# Altium schematic sheet Mother_Board.SchDoc
size A2; Author: Yaokun/Felix Zhang; Organization: Altium Limited; Address1: 21A144; Address2: Harbin Engineering University; Address3: Harbin; Address4: CHINA
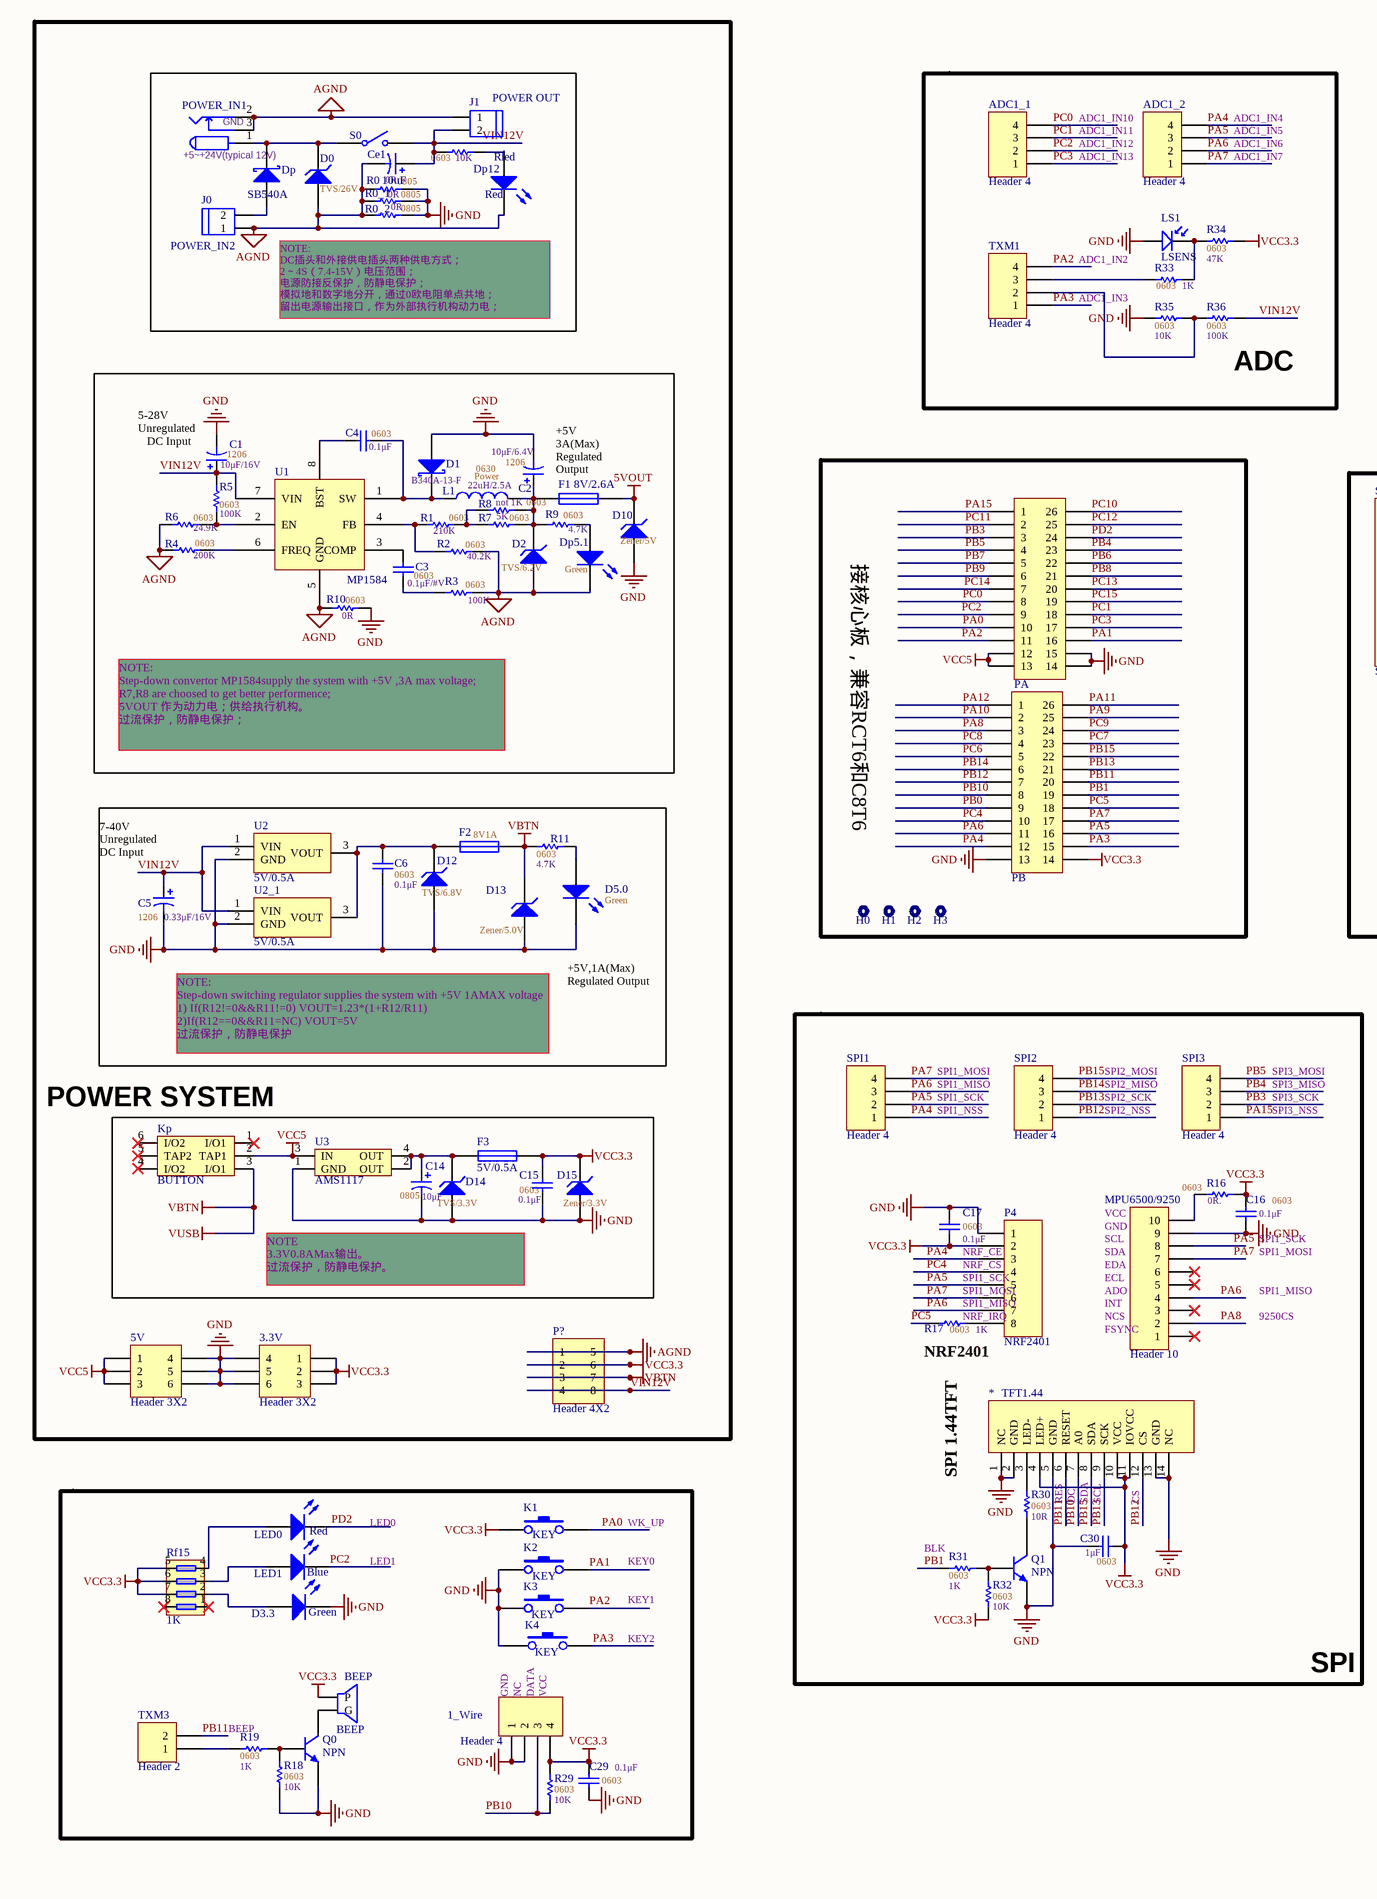
[diagram p0: Mother_Board.SchDoc, left]
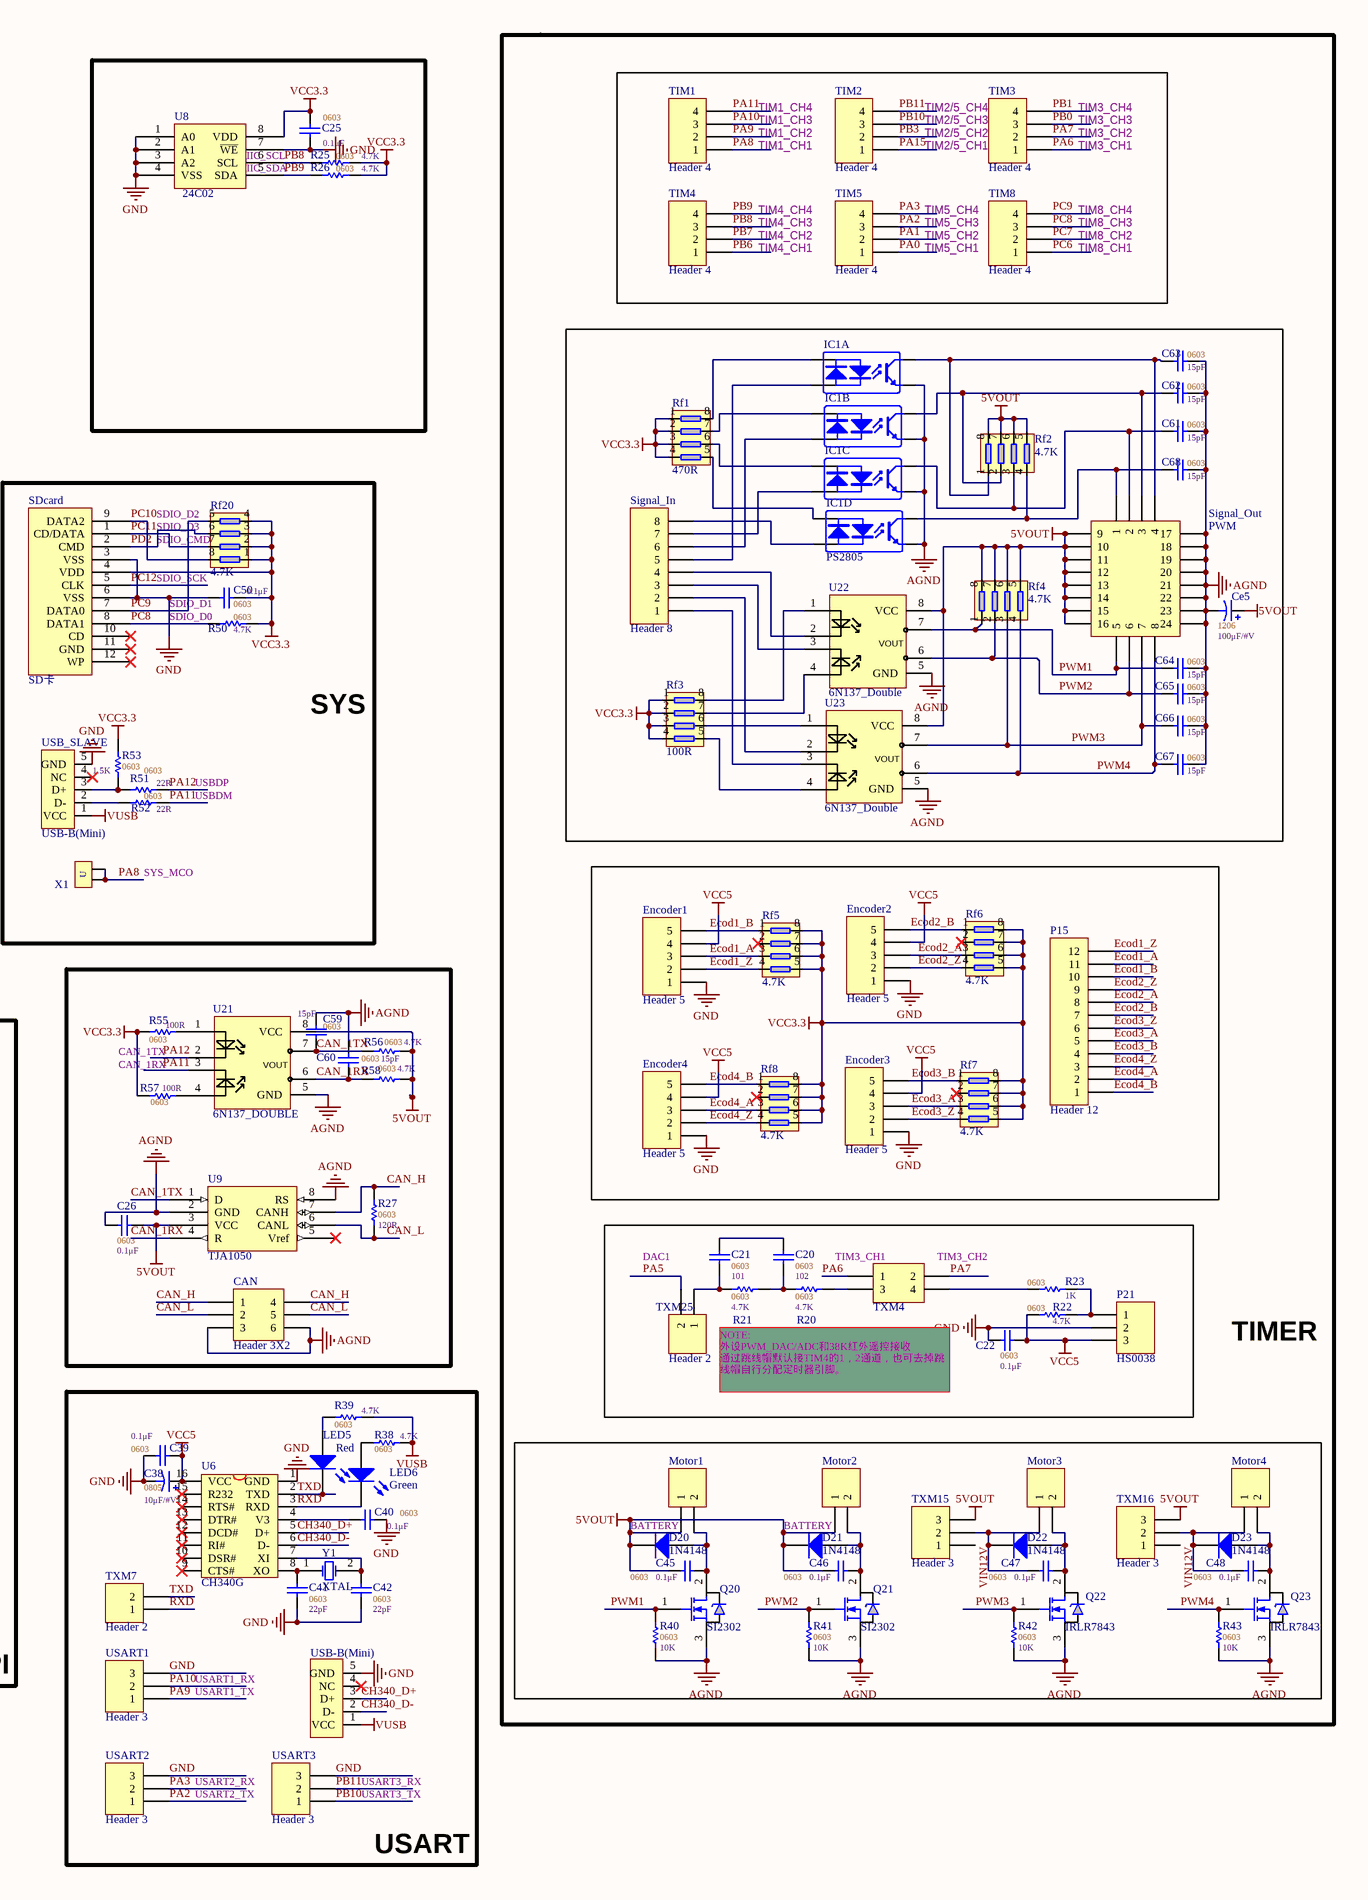
[diagram p1: Mother_Board.SchDoc, right]

## Parts
1_Wire  Header 4  [HEADER1*4_PIN]
3.3V  Header 3X2  [HEADER2*3_PIN]
5V  Header 3X2  [HEADER2*3_PIN]
*  TFT1.44  [TFT_1.44]
ADC1_1  Header 4  [HEADER1*4_PIN]
ADC1_2  Header 4  [HEADER1*4_PIN]
BEEP  BEEP  [BELL-5]
C1  value 10μF/16V  PackageReference: 1206  [CAP_1206]  (hidden comment: Polar)
C2  value 10μF/6.4V  PackageReference: 1206  [CAP_1206]  (hidden comment: Polar)
C3  value 0.1μF/#V  [CAP_0603_16*08]  (hidden comment: 0603)
C4  value 0.1μF  [CAP_0603_16*08]  (hidden comment: 0603)
C5  value 0.33μF/16V  PackageReference: 1206  [CAP_1206]  (hidden comment: Polar)
C6  value 0.1μF  [CAP_0603_16*08]  (hidden comment: 0603)
C14  value 10μF  PackageReference: 0805  [CAP_0805_20*12]  (hidden comment: Polar)
C15  value 0.1μF  [CAP_0603_16*08]  (hidden comment: 0603)
C16  value 0.1μF  [CAP_0603_16*08]  (hidden comment: 0603)
C17  value 0.1μF  [CAP_0603_16*08]  (hidden comment: 0603)
C20  value 102  [CAP_0603_16*08]  (hidden comment: 0603)
C21  value 101  [CAP_0603_16*08]  (hidden comment: 0603)
C22  value 0.1μF  [CAP_0603_16*08]  (hidden comment: 0603)
C25  value 0.1μF  [CAP_0603_16*08]  (hidden comment: 0603)
C26  value 0.1μF  [CAP_0603_16*08]  (hidden comment: 0603)
C29  value 0.1μF  [CAP_0603_16*08]  (hidden comment: 0603)
C30  value 1μF  [CAP_0603_16*08]  (hidden comment: 0603)
C38  value 10μF/#V  PackageReference: 0805  [CAP_0805_20*12]  (hidden comment: Polar)
C39  value 0.1μF  [CAP_0603_16*08]  (hidden comment: 0603)
C40  value 0.1μF  [CAP_0603_16*08]  (hidden comment: 0603)
C41  value 22pF  [CAP_0603_16*08]  (hidden comment: 0603)
C42  value 22pF  [CAP_0603_16*08]  (hidden comment: 0603)
C45  value 0.1μF  [CAP_0603_16*08]  (hidden comment: 0603)
C46  value 0.1μF  [CAP_0603_16*08]  (hidden comment: 0603)
C47  value 0.1μF  [CAP_0603_16*08]  (hidden comment: 0603)
C48  value 0.1μF  [CAP_0603_16*08]  (hidden comment: 0603)
C50  value 0.1μF  [CAP_0603_16*08]  (hidden comment: 0603)
C59  value 15pF  [CAP_0603_16*08]  (hidden comment: 0603)
C60  value 15pF  [CAP_0603_16*08]  (hidden comment: 0603)
C61  value 15pF  [CAP_0603_16*08]  (hidden comment: 0603)
C62  value 15pF  [CAP_0603_16*08]  (hidden comment: 0603)
C63  value 15pF  [CAP_0603_16*08]  (hidden comment: 0603)
C64  value 15pF  [CAP_0603_16*08]  (hidden comment: 0603)
C65  value 15pF  [CAP_0603_16*08]  (hidden comment: 0603)
C66  value 15pF  [CAP_0603_16*08]  (hidden comment: 0603)
C67  value 15pF  [CAP_0603_16*08]  (hidden comment: 0603)
C68  value 15pF  [CAP_0603_16*08]  (hidden comment: 0603)
CAN  Header 3X2  [HEADER2*3_PIN]
Ce1  10uF  [Cap_elc_330uF16V]
Ce5  value 100μF/#V  PackageReference: 1206  [C1210_M]  (hidden comment: Polar)
D0  TVS/26V  [SMB]
D1  B340A-13-F  [SMA]
D2  TVS/6.2V  [SOD523]
D3.3  Green  [LED_0805]
D5.0  Green  [LED_0805]
D10  Zener/5V  [SOD123]
D12  TVS/6.8V  [SOD523]
D13  Zener/5.0V  [SOD123]
D14  TVS/3.3V  [SOD523]
D15  Zener/3.3V  [SOD323]
D20  1N4148  [Diode1206]
D21  1N4148  [Diode1206]
D22  1N4148  [Diode1206]
D23  1N4148  [Diode1206]
Dp  SB540A  [SMA]
Dp5.1  Green  [LED_0805]
Dp12  Red  [LED_0805]
Encoder1  Header 5  [P5]
Encoder2  Header 5  [P5]
Encoder3  Header 5  [P5]
Encoder4  Header 5  [P5]
F1  8V/2.6A  [FUSE3.5*5.5]
F2  8V1A  [RES_0805_20*12]
F3  5V/0.5A  [RES_0805_20*12]
H0  Pad3mm  [PAD]  (value not drawn)
H1  Pad3mm  [PAD]  (value not drawn)
H2  Pad3mm  [PAD]  (value not drawn)
H3  Pad3mm  [PAD]  (value not drawn)
IC1  PS2805  [SOP16]  (value not drawn)  (parts A,B,C,D of 4)
J0  POWER_IN2  [POWER_PADS]
J1  POWER OUT  [HEAD2L-0.8]
K1  KEY  [KEY_2]
K2  KEY  [KEY_2]
K3  KEY  [KEY_2]
K4  KEY  [KEY_2]
Kp  BUTTON  [Switch_Self-Lock]
L1  value 22uH/2.5A  PackageReference: 0630  PackageDescription: Power  [IND_SMD22uh]  (hidden comment: MODEL?)
LED0  Red  [LED_0805]
LED1  Blue  [LED_0805]
LED5  Red  [CAP_0603_16*08]
LED6  Green  [CAP_0603_16*08]
LS1  LSENS  [HeadER1*2_pin]
Motor1  Header 2  [HeadER1*2_pin]  (value not drawn)
Motor2  Header 2  [HeadER1*2_pin]  (value not drawn)
Motor3  Header 2  [HeadER1*2_pin]  (value not drawn)
Motor4  Header 2  [HeadER1*2_pin]  (value not drawn)
MPU6500/9250  Header 10  [HEADER1*10_PIN]
P4  NRF2401  [HDR2X4]
P15  Header 12  [HEADER1*12_PIN]
P21  HS0038  [HEADER1*3_PIN]
P?  Header 4X2  [HEADER2*4_PIN]
PA  Header  [HEADER2*13_SMD]  (value not drawn)
PB  Header  [HEADER2*13_SMD]  (value not drawn)
POWER_IN1  POWER  [POW_DC]  (value not drawn)
Q0  NPN  [SOT23_J3Y]
Q1  NPN  [SOT23_J3Y]
Q20  SI2302  [SOT-23_MOSN]
Q21  SI2302  [SOT-23_MOSN]
Q22  IRLR7843  [DPAK]
Q23  IRLR7843  [DPAK]
R0  value 0R  PackageReference: 0805  [RES_0805_20*12]  (hidden comment: SMD)
R0_1  value 0R  PackageReference: 0805  [RES_0805_20*12]  (hidden comment: SMD)
R0_2  value 0R  PackageReference: 0805  [RES_0805_20*12]  (hidden comment: SMD)
R1  0603  value 210K  [RES_0603_16*08]
R2  0603  value 40.2K  [RES_0603_16*08]
R3  0603  value 100K  [RES_0603_16*08]
R4  0603  value 200K  [RES_0603_16*08]
R5  0603  value 100K  [RES_0603_16*08]
R6  0603  value 24.9K  [RES_0603_16*08]
R7  0603  value 5K  [RES_0603_16*08]
R8  0603  value not 1K  [RES_0603_16*08]
R9  value 4.7K  PackageReference: 0603  [RES_0603_16*08]  (hidden comment: SMD)
R10  value 0R  PackageReference: 0603  [RES_0805_20*12]  (hidden comment: SMD)
R11  value 4.7K  PackageReference: 0603  [RES_0603_16*08]  (hidden comment: SMD)
R16  value 0R.  PackageReference: 0603  [RES_0603_16*08]  (hidden comment: SMD)
R17  value 1K  PackageReference: 0603  [RES_0603_16*08]  (hidden comment: SMD)
R18  value 10K  PackageReference: 0603  [RES_0603_16*08]  (hidden comment: SMD)
R19  value 1K  PackageReference: 0603  [RES_0603_16*08]  (hidden comment: SMD)
R20  value 4.7K  PackageReference: 0603  [RES_0603_16*08]  (hidden comment: SMD)
R21  value 4.7K  PackageReference: 0603  [RES_0603_16*08]  (hidden comment: SMD)
R22  value 4.7K  PackageReference: 0603  [RES_0603_16*08]  (hidden comment: SMD)
R23  value 1K  PackageReference: 0603  [RES_0603_16*08]  (hidden comment: SMD)
R25  value 4.7K  PackageReference: 0603  [RES_0603_16*08]  (hidden comment: SMD)
R26  value 4.7K  PackageReference: 0603  [RES_0603_16*08]  (hidden comment: SMD)
R27  value 120R  PackageReference: 0603  [RES_0603_16*08]  (hidden comment: SMD)
R29  value 10K  PackageReference: 0603  [RES_0603_16*08]  (hidden comment: SMD)
R30  value 10R  PackageReference: 0603  [RES_0603_16*08]  (hidden comment: SMD)
R31  value 1K  PackageReference: 0603  [RES_0603_16*08]  (hidden comment: SMD)
R32  value 10K  PackageReference: 0603  [RES_0603_16*08]  (hidden comment: SMD)
R33  value 1K  PackageReference: 0603  [RES_0603_16*08]  (hidden comment: SMD)
R34  value 47K  PackageReference: 0603  [RES_0603_16*08]  (hidden comment: SMD)
R35  value 10K  PackageReference: 0603  [RES_0603_16*08]  (hidden comment: SMD)
R36  value 100K  PackageReference: 0603  [RES_0603_16*08]  (hidden comment: SMD)
R38  value 4.7K  PackageReference: 0603  [RES_0603_16*08]  (hidden comment: SMD)
R39  value 4.7K  PackageReference: 0603  [RES_0603_16*08]  (hidden comment: SMD)
R40  value 10K  PackageReference: 0603  [RES_0603_16*08]  (hidden comment: SMD)
R41  value 10K  PackageReference: 0603  [RES_0603_16*08]  (hidden comment: SMD)
R42  value 10K  PackageReference: 0603  [RES_0603_16*08]  (hidden comment: SMD)
R43  value 10K  PackageReference: 0603  [RES_0603_16*08]  (hidden comment: SMD)
R50  value 4.7K  PackageReference: 0603  [RES_0603_16*08]  (hidden comment: SMD)
R51  value 22R  PackageReference: 0603  [RES_0603_16*08]  (hidden comment: SMD)
R52  value 22R  PackageReference: 0603  [RES_0603_16*08]  (hidden comment: SMD)
R53  value 1.5K  PackageReference: 0603  [RES_0603_16*08]  (hidden comment: SMD)
R55  value 100R  PackageReference: 0603  [RES_0603_16*08]  (hidden comment: SMD)
R56  value 4.7K  PackageReference: 0603  [RES_0603_16*08]  (hidden comment: SMD)
R57  value 100R  PackageReference: 0603  [RES_0603_16*08]  (hidden comment: SMD)
R58  value 4.7K  PackageReference: 0603  [RES_0603_16*08]  (hidden comment: SMD)
Rf1  470R  [RES_FOUR_0603]
Rf2  4.7K  [RES_FOUR_0603]
Rf3  100R  [RES_FOUR_0603]
Rf4  4.7K  [RES_FOUR_0603]
Rf5  4.7K  [RES_FOUR_0603]
Rf6  4.7K  [RES_FOUR_0603]
Rf7  4.7K  [RES_FOUR_0603]
Rf8  4.7K  [RES_FOUR_0603]
Rf15  1K  [RES_FOUR_0603]
Rf20  4.7K  [RES_FOUR_0603]
Rled  value 10K  PackageReference: 0603  [RES_0603_16*08]  (hidden comment: SMD)
S0  SW-SPST  [Switch_boat_s]  (value not drawn)
SDcard  SD卡  [SDCARD_L]
Signal_In  Header 8  [HEADER1*8_PIN]
Signal_Out  PWM  [HEADER3*8]
SPI1  Header 4  [HEADER1*4_PIN]
SPI2  Header 4  [HEADER1*4_PIN]
SPI3  Header 4  [HEADER1*4_PIN]
TIM1  Header 4  [HEADER1*4_PIN]
TIM2  Header 4  [HEADER1*4_PIN]
TIM3  Header 4  [HEADER1*4_PIN]
TIM4  Header 4  [HEADER1*4_PIN]
TIM5  Header 4  [HEADER1*4_PIN]
TIM8  Header 4  [HEADER1*4_PIN]
TXM1  Header 4  [HEADER1*4_PIN]
TXM3  Header 2  [HeadER1*2_pin]
TXM4  Header 2X2  [HEADER2*2_PIN]  (value not drawn)
TXM7  Header 2  [HeadER1*2_pin]
TXM15  Header 3  [HEADER1*3_PIN]
TXM16  Header 3  [HEADER1*3_PIN]
TXM25  Header 2  [HeadER1*2_pin]
U1  MP1584  [SOIC8E]
U2  5V/0.5A  [DPAK]
U2_1  5V/0.5A  [DPAK]
U3  AMS1117  [SOT223_M]
U6  CH340G  [SOP16]
U8  24C02  [SO8_M]
U9  TJA1050  [SO8_M]
U21  6N137_DOUBLE  [SMD-8/Option7]
U22  6N137_Double  [SMD-8/Option7]
U23  6N137_Double  [SMD-8/Option7]
USART1  Header 3  [HEADER1*3_PIN]
USART2  Header 3  [HEADER1*3_PIN]
USART3  Header 3  [HEADER1*3_PIN]
USB_SLAVE  USB-B(Mini)  [USB_micro_S]
USB_SLAVE1  USB-B(Mini)  [USB/SM0.8-6H5]
X1  U HDR  [Header_U]  (value not drawn)
Y1  XTAL  [XTAL_US]

## Blocks framed on the sheet
POWER SYSTEM: 3.3V 5V C1-C6 C14 C15 Ce1 D0-D2 D5.0 D10 D12-D15 Dp Dp5.1 Dp12 F1-F3 J0 J1 Kp L1 P? POWER_IN1 R0 R0_1 R0_2 R1-R11 Rled S0 U1 U2 U2_1 U3
TIMER: C20-C22 C45-C48 C61-C68 Ce5 D20-D23 Encoder1-Encoder4 IC1 Motor1-Motor4 P15 P21 Q20-Q23 R20-R23 R40-R43 Rf1-Rf8 Signal_In Signal_Out TIM1-TIM5 TIM8 TXM4 TXM15 TXM16 TXM25 U22 U23
ADC: ADC1_1 ADC1_2 LS1 R33-R36 TXM1
接核心板，兼容RCT6和C8T6: H0-H3 PA PB
SYS: C50 R50-R53 Rf20 SDcard USB_SLAVE X1
SPI: * C16 C17 C30 MPU6500/9250 P4 Q1 R16 R17 R30-R32 SPI1-SPI3
USART: C38-C42 LED5 LED6 R38 R39 TXM7 U6 USART1-USART3 USB_SLAVE1 Y1

## Nets
5VOUT: C26.2 C45.1 C46.1 Ce5.1 D10.2(K) D20.2(K) D21.2(K) F1.2 Motor1.1 Motor2.1 R56.1 R58.1 Rf2.5 Rf2.6 Rf2.7 Rf2.8 Rf4.5 Rf4.6 Rf4.7 Rf4.8 Signal_Out.9 Signal_Out.10 Signal_Out.11 Signal_Out.12 Signal_Out.13 Signal_Out.14 Signal_Out.15 Signal_Out.16 TXM15.3 TXM16.3 U9.3(VCC) U21.8(VCC) U22.8(VCC) U23.8(VCC)
AGND: C26.1 C59.2 C60.2 C61.2 C62.2 C63.2 C64.2 C65.2 C66.2 C67.2 C68.2 CAN.3 CAN.6 Ce1.2 Ce5.2 D0.1(A) D2.1(A) Dp5.1.2(K) Dp12.2(K) IC1.9 IC1.11 IC1.13 IC1.15 J0.1 J1.1 P?.1 P?.5 POWER_IN1.2(GND) POWER_IN1.3(GND) Q20.3(S) Q21.3(S) Q22.3(S) Q23.3(S) R0.1 R0_1.1 R0_2.1 R2.2 R3.1 R4.2 R6.1 R10.1 R40.1 R41.1 R42.1 R43.1 Signal_Out.17 Signal_Out.18 Signal_Out.19 Signal_Out.20 Signal_Out.21 Signal_Out.22 Signal_Out.23 Signal_Out.24 U1.5(GND) U9.2(GND) U9.8(RS) U21.5(GND) U22.5(GND) U23.5(GND)
GND: 1_Wire.1 1_Wire.2 3.3V.4 3.3V.5 3.3V.6 5V.4 5V.5 5V.6 *.1(NC) *.2(GND) *.5(GND) *.13(GND) *.14(NC) C1.2 C2.2 C5.2 C6.1 C14.2 C15.1 C16.1 C17.2 C22.2 C25.1 C29.1 C30.1 C38.2 C39.1 C40.2 C41.1 C42.1 C50.1 D1.1(A) D3.3.2(K) D5.0.2(K) D10.1(A) D12.1(A) D13.1(A) D14.1(A) D15.1(A) Encoder1.1 Encoder2.1 Encoder3.1 Encoder4.1 K2.1 K3.1 K4.1 LS1.1 MPU6500/9250.9 P4.1 P21.2 PA.14 PA.15 PB.13 Q0.3(E) Q1.3(E) R0.2 R0_1.2 R0_2.2 R10.2 R18.1 R35.1 SDcard.3(VSS) SDcard.6(VSS) U2.2(GND) U2_1.2(GND) U3.1(GND) U6.1(GND) U8.1(A0) U8.2(A1) U8.3(A2) U8.4(VSS) U8.7(~{WE}) USART1.3 USART2.3 USART3.3 USB_SLAVE.5(GND) USB_SLAVE1.5(GND)
VBTN: D13.2(K) F2.2 Kp.3(I/O1) P?.3 P?.7 R11.1 R38.1 R39.2 USB_SLAVE.1(VCC) USB_SLAVE1.1(VCC)  [also labelled VUSB]
VCC3.3: 1_Wire.4 3.3V.1 3.3V.2 3.3V.3 *.4(LED+) *.10(VCC) *.11(IOVCC) BEEP.1(P) C15.2 C16.2 C17.1 C25.2 C29.2 C30.2 C50.2 D15.2(K) F3.2 K1.1 P4.2 P?.2 P?.6 PB.14 R16.1 R25.2 R26.2 R29.2 R32.1 R34.2 R50.2 R53.2 R55.1 R57.1 Rf1.1 Rf1.2 Rf1.3 Rf1.4 Rf3.1 Rf3.2 Rf3.3 Rf3.4 Rf5.5 Rf5.6 Rf5.7 Rf5.8 Rf6.5 Rf6.6 Rf6.7 Rf6.8 Rf7.5 Rf7.6 Rf7.7 Rf7.8 Rf8.5 Rf8.6 Rf8.7 Rf8.8 Rf15.5 Rf15.6 Rf15.7 Rf20.1 Rf20.2 Rf20.3 Rf20.4 SDcard.4(VDD) U8.8(VDD)
VCC5: 5V.1 5V.2 5V.3 C22.1 C38.1 C39.2 Encoder1.4 Encoder2.4 Encoder3.4 Encoder4.4 Kp.2(TAP1) P21.3 PA.12 PA.13 R22.2 U3.3(IN) U6.16(VCC)
CAN_1RX: C60.1 R58.2 U9.4(R) U21.6(VOUT)
CAN_1TX: C59.1 R56.2 U9.1(D) U21.7
CAN_H: CAN.1 CAN.4 R27.2 U9.7(CANH)
CAN_L: CAN.2 CAN.5 R27.1 U9.6(CANL)
CH340_D+: U6.5(D+) USB_SLAVE1.3(D+)
CH340_D-: U6.6(D-) USB_SLAVE1.2(D-)
Ecod1_A: Encoder1.3 P15.11 Rf5.3
Ecod1_B: Encoder1.5 P15.10 Rf5.1
Ecod1_Z: Encoder1.2 P15.12 Rf5.4
Ecod2_A: Encoder2.3 P15.8 Rf6.3
Ecod2_B: Encoder2.5 P15.7 Rf6.1
Ecod2_Z: Encoder2.2 P15.9 Rf6.4
Ecod3_A: Encoder3.3 P15.5 Rf7.3
Ecod3_B: Encoder3.5 P15.4 Rf7.1
Ecod3_Z: Encoder3.2 P15.6 Rf7.4
Ecod4_A: Encoder4.3 P15.2 Rf8.3
Ecod4_B: Encoder4.5 P15.1 Rf8.1
Ecod4_Z: Encoder4.2 P15.3 Rf8.4
PA0: K1.2 PA.10 TIM5.1
PA1: K2.2 PA.16 TIM5.2
PA2: K3.2 PA.11 TIM5.3 TXM1.4 USART2.1
PA3: K4.2 PB.15 TIM5.4 TXM1.1 USART2.2
PA4: ADC1_2.4 P4.3 PB.12 SPI1.1
PA5: ADC1_2.3 MPU6500/9250.8 P4.5 PB.16 SPI1.2 TXM25.2
PA6: ADC1_2.2 MPU6500/9250.4 P4.7 PB.11 SPI1.3 TIM3.1 TXM4.1
PA7: ADC1_2.1 MPU6500/9250.7 P4.6 PB.17 SPI1.4 TIM3.2 TXM4.2
PA8: MPU6500/9250.2 PB.3 TIM1.1 X1.1 X1.2
PA9: PB.25 TIM1.2 USART1.1
PA10: PB.2 TIM1.3 USART1.2
PA11: PB.26 R52.2 TIM1.4 U21.3
PA12: PB.1 R51.2 U21.2
PA15: PA.1 SPI3.1 TIM2.1
PB0: PB.9 TIM3.3
PB1: PB.19 R31.1 TIM3.4
PB3: PA.3 SPI3.2 TIM2.2
PB4: PA.23 SPI3.3
PB5: PA.4 SPI3.4
PB6: PA.22 TIM4.1
PB7: PA.5 TIM4.2
PB8: PA.21 R25.1 TIM4.3 U8.6(SCL)
PB9: PA.6 R26.1 TIM4.4 U8.5(SDA)
PB10: 1_Wire.3 *.7(A0) PB.8 R29.1 TIM2.3 USART3.1
PB11: *.6(RESET) PB.20 TIM2.4 TXM3.2 USART3.2
PB12: *.12(CS) PB.7 SPI2.1
PB13: *.9(SCK) PB.21 SPI2.2
PB14: PB.6 SPI2.3
PB15: *.8(SDA) PB.22 SPI2.4
PC0: ADC1_1.4 PA.8
PC1: ADC1_1.3 PA.18
PC2: ADC1_1.2 LED1.2(K) PA.9
PC3: ADC1_1.1 PA.17
PC4: P4.4 PB.10
PC5: PB.18 R17.1
PC6: PB.5 TIM8.1
PC7: PB.23 TIM8.2
PC8: PB.4 R50.1 SDcard.8(DATA1) TIM8.3
PC9: PB.24 Rf20.5 SDcard.7(DATA0) TIM8.4
PC10: PA.26 Rf20.8 SDcard.9(DATA2)
PC11: PA.2 Rf20.7 SDcard.1(CD/DATA)
PC12: PA.25 SDcard.5(CLK)
PC13: PA.20
PC14: PA.7
PC15: PA.19
PD2: LED0.2(K) PA.24 Rf20.6 SDcard.2(CMD)
PWM1: C64.1 Q20.1(G) R40.2 Rf4.1 Signal_Out.5 U22.7
PWM2: C65.1 Q21.1(G) R41.2 Rf4.2 Signal_Out.6 U22.6(VOUT)
PWM3: C66.1 Q22.1(G) R42.2 Rf4.3 Signal_Out.7 U23.7
PWM4: C67.1 Q23.1(G) R43.2 Rf4.4 Signal_Out.8 U23.6(VOUT)
RXD: LED6.2(K) TXM7.1 U6.3(RXD)
TXD: LED5.2(K) TXM7.2 U6.2(TXD)
VIN12V: C1.1 C5.1 Ce1.1(+) J1.2 P?.4 P?.8 R5.2 R36.2 Rled.2 S0.2(NO) TXM15.1 TXM16.1 U1.7(VIN) U2.1(VIN) U2_1.1(VIN)
Net*_3: *.3(LED-) R30.2
NetBEEP_2: BEEP.2(G) Q0.1(C)
NetC2_1: C2.1 D2.2(K) F1.1 L1.2 R7.2 R8.2 R9.2
NetC3_1: C3.1 R3.2
NetC3_2: C3.2 U1.3(COMP)
NetC4_1: C4.1 U1.8(BST)
NetC4_2: C4.2 D1.2(K) L1.1 U1.1(SW)
NetC6_2: C6.2 D12.2(K) F2.1 U2.3(VOUT) U2_1.3(VOUT)
NetC14_1: C14.1 D14.2(K) F3.1 U3.2(OUT) U3.4(OUT)
NetC20_1: C20.1 C21.1
NetC20_2: C20.2 R20.2 R21.1
NetC21_2: C21.2 R21.2 TXM25.1
NetC40_1: C40.1 U6.4(V3)
NetC41_2: C41.2 U6.8(XO) Y1.1(OSC1)
NetC42_2: C42.2 U6.7(XI) Y1.2(OSC2)
NetC45_2: C45.2 D20.1(A) Motor1.2 Q20.2(D)
NetC46_2: C46.2 D21.1(A) Motor2.2 Q21.2(D)
NetC47_1: C47.1 D22.2(K) Motor3.1 TXM15.2
NetC47_2: C47.2 D22.1(A) Motor3.2 Q22.2(D)
NetC48_1: C48.1 D23.2(K) Motor4.1 TXM16.2
NetC48_2: C48.2 D23.1(A) Motor4.2 Q23.2(D)
NetC61_1: C61.1 IC1.12 Rf2.3 Signal_Out.2
NetC62_1: C62.1 IC1.14 Rf2.2 Signal_Out.3
NetC63_1: C63.1 IC1.16 Rf2.1 Signal_Out.4
NetC68_1: C68.1 IC1.10 Rf2.4 Signal_Out.1
NetD0_2: D0.2(K) Dp.2(K) POWER_IN1.1 S0.1(COMMON)
NetD3.3_1: D3.3.1(A) Rf15.2
NetD5.0_1: D5.0.1(A) R11.2
NetDp5.1_1: Dp5.1.1(A) R9.1
NetDp12_1: Dp12.1(A) Rled.1
NetDp_1: Dp.1(A) J0.2
NetIC1_1: IC1.1 Rf1.8
NetIC1_2: IC1.2 Signal_In.5
NetIC1_3: IC1.3 Rf1.7
NetIC1_4: IC1.4 Signal_In.6
NetIC1_5: IC1.5 Rf1.6
NetIC1_6: IC1.6 Signal_In.7
NetIC1_7: IC1.7 Rf1.5
NetIC1_8: IC1.8 Signal_In.8
NetLED0_1: LED0.1(A) Rf15.4
NetLED1_1: LED1.1(A) Rf15.3
NetLED5_1: LED5.1(A) R39.1
NetLED6_1: LED6.1(A) R38.2
NetLS1_2: LS1.2 R33.2 R34.1
NetMPU6500/9250_10: MPU6500/9250.10 R16.2
NetP4_8: P4.8 R17.2
NetP21_1: P21.1 R22.1 R23.2
NetQ0_2: Q0.2(B) R18.2 R19.2
NetQ1_1: Q1.1(C) R30.1
NetQ1_2: Q1.2(B) R31.2 R32.2
NetR1_1: R1.1 R2.1 U1.4(FB)
NetR1_2: R1.2 R7.1 R8.1
NetR4_1: R4.1 U1.6(FREQ)
NetR5_1: R5.1 R6.2 U1.2(EN)
NetR19_1: R19.1 TXM3.1
NetR20_1: R20.1 TXM4.3
NetR23_1: R23.1 TXM4.4
NetR33_1: R33.1 TXM1.3
NetR35_2: R35.2 R36.1 TXM1.2
NetR51_1: R51.1 R53.1 USB_SLAVE.3(D+)
NetR52_1: R52.1 USB_SLAVE.2(D-)
NetR55_2: R55.2 U21.1
NetR57_2: R57.2 U21.4
NetRf3_5: Rf3.5 U23.4
NetRf3_6: Rf3.6 U23.1
NetRf3_7: Rf3.7 U22.4
NetRf3_8: Rf3.8 U22.1
NetSignal_In_1: Signal_In.1 U23.3
NetSignal_In_2: Signal_In.2 U23.2
NetSignal_In_3: Signal_In.3 U22.3
NetSignal_In_4: Signal_In.4 U22.2

Not connected (* = marked no-connect by the designer): Kp 1(I/O1)* 4(I/O2)* 5(TAP2)* 6(I/O2)*; MPU6500/9250 1* 3* 5* 6*; Rf5 2*; Rf6 2*; Rf7 2*; Rf8 2*; Rf15 1* 8*; SDcard 10(CD)* 11(GND)* 12(WP)*; U6 9(CTS#)* 10(DSR#)* 11(RI#)* 12(DCD#)* 13(DTR#)* 14(RTS#)* 15(R232)*; U9 5(Vref)*; USB_SLAVE 4(NC)*; USB_SLAVE1 4(NC)*

## Notes on the sheet
- TIM1_CH2
- TIM1_CH3
- TIM1_CH4
- TIM2/5_CH2
- TIM2/5_CH3
- TIM2/5_CH4
- TIM3_CH2
- TIM3_CH3
- TIM3_CH4
- ADC1_IN10
- ADC1_IN11
- ADC1_IN12
- ADC1_IN13
- ADC1_IN4
- ADC1_IN5
- ADC1_IN6
- ADC1_IN7
- (near U8) IIC_SCL
- (near U8) IIC_SDA
- TIM1_CH1
- TIM2/5_CH1
- TIM3_CH1
- TIM4_CH1
- TIM4_CH2
- TIM4_CH3
- TIM4_CH4
- TIM5_CH1
- TIM5_CH2
- TIM5_CH3
- TIM5_CH4
- TIM8_CH1
- TIM8_CH2
- TIM8_CH3
- TIM8_CH4
- ADC1_IN2
- ADC1_IN3
- NOTE:
  DC插头和外接供电插头两种供电方式；
  2～4S（7.4-15V）电压范围；
  电源防接反保护，防静电保护；
  模拟地和数字地分开，通过0欧电阻单点共地；
  留出电源输出接口，作为外部执行机构动力电；
- (near C1) 5-28V
  Unregulated
  DC Input
- +5V
  3A(Max)
  Regulated Output
- (near Rf20) SDIO_D2
- (near Rf20) SDIO_D3
- (near Rf20) SDIO_CMD
- SDIO_SCK
- SDIO_D0
- SDIO_D1
- NOTE:
  Step-down convertor MP1584supply the system with +5V ,3A max voltage;
  R7,R8 are choosed to get better performence;
  5VOUT 作为动力电；供给执行机构。
  过流保护，防静电保护；
- USBDP
- USBDM
- (near C5) 7-40V
  Unregulated
  DC Input
- SYS_MCO
- +5V,1A(Max)
  Regulated Output
- NOTE:
  Step-down switching regulator supplies the system with +5V 1AMAX voltage
  1) If(R12!=0&&R11!=0)	VOUT=1.23*(1+R12/R11)
  2)If(R12==0&&R11=NC)	VOUT=5V
  过流保护，防静电保护
- SPI1_MOSI
- SPI2_MOSI
- SPI3_MOSI
- (near R55) CAN_1TX
- CAN_1RX
- SPI1_MISO
- SPI1_SCK
- SPI1_NSS
- SPI2_MISO
- SPI2_SCK
- SPI2_NSS
- SPI3_MISO
- SPI3_SCK
- SPI3_NSS
- (near P4) NRF_CE
- (near P4) NRF_CS
- (near MPU6500/9250) VCC
- (near MPU6500/9250) GND
- (near MPU6500/9250) SCL
- (near MPU6500/9250) SDA
- (near MPU6500/9250) EDA
- (near C16) SPI1_SCK
- (near C16) SPI1_MOSI
- DAC1
- (near TXM4) TIM3_CH1
- (near TXM4) TIM3_CH2
- NOTE
  3.3V0.8AMax输出。
  过流保护，防静电保护。
- (near P4) SPI1_SCK
- (near P4) SPI1_MOSI
- (near P4) SPI1_MISO
- (near R17) NRF_IRQ
- (near MPU6500/9250) ECL
- (near MPU6500/9250) ADO
- (near MPU6500/9250) INT
- (near MPU6500/9250) NCS
- (near MPU6500/9250) FSYNC
- 9250CS
- NRF2401
- NOTE:
  外设PWM_DAC/ADC和38K红外遥控接收
  通过跳线帽默认接TIM4的1，2通道，也可去掉跳线帽自行分配定时器引脚。
- LED0
- WK_UP
- SPI 1.44TFT
- RES
- DC
- SDA
- SCL
- CS
- BATTERY
- LED1
- KEY0
- (near R31) BLK
- KEY1
- KEY2
- GND
- NC
- DATA
- VCC
- USART1_RX
- USART1_TX
- (near R19) BEEP
- USART2_RX
- USART3_RX
- USART2_TX
- USART3_TX
- Title
- Size:
- Date:
- File:
- A2
- Number:
- Time:
- Revision:
- Sheet
- of
- Author:
- (in symbol Header_U) U
- (in symbol POW_DC) +5~+24V(typical 12V)

## Library data of the parts
1_Wire ADC1_1 ADC1_2 SPI1-SPI3 TIM1-TIM5 TIM8 TXM1 = Header 4: Header, 4-Pin; LatestRevisionDate: 17-Jul-2002; LatestRevisionNote: Re-released for DXP Platform.; Publisher: Altium Limited
3.3V 5V CAN = Header 3X2: Header, 3-Pin, Dual row; LatestRevisionDate: 17-Jul-2002; LatestRevisionNote: Re-released for DXP Platform.; Publisher: Altium Limited
C1 C2 C5 C14 C38 Ce5 = Cap Pol: Polarized Capacitor (Axial); Published: 1206; LatestRevisionDate: 17-Jul-2002; LatestRevisionNote: Re-released for DXP Platform.; Publisher: Altium Limited; PackageDescription: Polar
C3 C4 C6 C15-C17 C20-C22 C25 C26 C29 C30 C39-C42 C45-C48 C50 C59-C68 = Cap: Capacitor; Published: 8-Jun-2000; LatestRevisionDate: 17-Jul-2002; LatestRevisionNote: Re-released for DXP Platform.; Publisher: Altium Limited; PackageDescription: 0603
  C3 C4: PackageReference: RAD-0.3
  C6 C15-C17 C20-C22 C25 C26 C29 C30 C39-C42 C45-C48 C50 C59-C68: PackageReference: 0603
Ce1 = Cap Elec
D0 D2 D10 D12-D15 = D Zener: Zener Diode; Published: 8-Jun-2000; LatestRevisionDate: 17-Jul-2002; LatestRevisionNote: Re-released for DXP Platform.; PackageReference: DIODE-0.7; Publisher: Altium Limited; PackageDescription: Diode, Thru-Hole; 2 Leads; 0.7 in Pin Spacing
D1 Dp = D Schottky: Schottky Diode; Published: 8-Jun-2000; LatestRevisionDate: 17-Jul-2002; LatestRevisionNote: Re-released for DXP Platform.; PackageReference: SMB; Publisher: Altium Limited; PackageDescription: DO-214-AA/SMB; 2 C-Bend Leads; Body 5.3 x 3.6 mm, inc. leads (LxW); Code_JEDEC: DO-214-AA
D3.3 D5.0 Dp5.1 Dp12 LED0 LED1 LED5 LED6 = LED: Typical RED, GREEN, YELLOW, AMBER GaAs LED; Published: 8-Jun-2000; LatestRevisionDate: 17-Jul-2002; LatestRevisionNote: Re-released for DXP Platform.; PackageVersion: Feb-2002; PackageReference: 3.2X1.6X1.1; Publisher: Altium Limited; PackageDescription: SM LED; 2 Flat Leads
D20-D23 = Diode: Default Diode; Published: 8-Jun-2000; LatestRevisionDate: 17-Jul-2002; LatestRevisionNote: Re-released for DXP Platform.; PackageVersion: Sep-1996; PackageReference: SMC; Publisher: Altium Limited; PackageDescription: DO-214-AB/SMC; 2 C-Bend Leads; Body 7.9 x 5.9 mm, inc. leads (LxW); Code_JEDEC: DO-214-AB
Encoder1-Encoder4 = Header 5: Header, 5-Pin; LatestRevisionDate: 17-Jul-2002; LatestRevisionNote: Re-released for DXP Platform.; Publisher: Altium Limited
F1-F3 = Fuse 1: Fuse; Published: 8-Jun-2000; LatestRevisionDate: 17-Jul-2002; LatestRevisionNote: Re-released for DXP Platform.; PackageReference: PIN-W2/E2.8; Publisher: Altium Limited; PackageDescription: Thru-Hole; 2 Leads
IC1 = PS2805-4
J0 J1 = HEAD2
Kp = SW_PUSH6
L1 = Inductor: Code_IEC: 1005; Published: 8-Jun-2000; LatestRevisionDate: 29-May-2009; LatestRevisionNote: IPC-7351 Footprint Added.; Publisher: Altium Limited; Code_JEITA: 0402
LS1 = LSENS: LIGHT SENS
Motor1-Motor4 TXM3 TXM7 TXM25 = Header 2: Header, 2-Pin; LatestRevisionDate: 17-Jul-2002; LatestRevisionNote: Re-released for DXP Platform.; Publisher: Altium Limited
MPU6500/9250 = Header 10: Header, 10-Pin; LatestRevisionDate: 17-Jul-2002; LatestRevisionNote: Re-released for DXP Platform.; Publisher: Altium Limited
P4 Signal_In = Header 8: Header, 8-Pin; LatestRevisionDate: 17-Jul-2002; LatestRevisionNote: Re-released for DXP Platform.; Publisher: Altium Limited
P15 = Header 12: Header, 12-Pin; LatestRevisionDate: 17-Jul-2002; LatestRevisionNote: Re-released for DXP Platform.; Publisher: Altium Limited
P21 TXM15 TXM16 USART1-USART3 = Header 3: Header, 3-Pin; LatestRevisionDate: 17-Jul-2002; LatestRevisionNote: Re-released for DXP Platform.; Publisher: Altium Limited
P? = Header 4X2: Header, 4-Pin, Dual row; LatestRevisionDate: 17-Jul-2002; LatestRevisionNote: Re-released for DXP Platform.; Publisher: Altium Limited
PA PB = Header13*2
POWER_IN1 = POW_DC
Q0 Q1 = NPN: NPN Bipolar Transistor; Published: 8-Jun-2000; LatestRevisionDate: 17-Jul-2002; LatestRevisionNote: Re-released for DXP Platform.; PackageReference: TO-226-AA; Publisher: Altium Limited; PackageDescription: TO, Flat Index; 3 In-Line, Axial Leads; Body Dia. 4.8mm; Leads 0.55 x 0.51 mm (max); Code_JEDEC: TO-226-AA
Q20-Q23 = MOSFET-N: N-Channel MOSFET; Published: 8-Jun-2000; LatestRevisionDate: 17-Jul-2002; LatestRevisionNote: Re-released for DXP Platform.; PackageVersion: 1995/1996; PackageReference: E3; Publisher: Altium Limited; PackageDescription: TO, Flat Index; 3 In-Line, Axial Leads; Body Dia. 4.6mm; Lead Dia. 0.5 mm (max)
R0 R0_1 R0_2 R1-R11 R16-R23 R25-R27 R29-R36 R38-R43 R50-R53 R55-R58 Rled = RES_SMD: Resistor; Published: 8-Jun-2000; LatestRevisionDate: 17-Jul-2002; LatestRevisionNote: Re-released for DXP Platform.; Publisher: Altium Limited
  R0 R0_1 R0_2 R9-R11 R16-R23 R25-R27 R29-R36 R38-R43 R50-R53 R55-R58 Rled: PackageDescription: SMD
  R1-R8: PackageReference: AXIAL-0.3; PackageDescription: Axial Device, Thru-Hole; 2 Leads; 0.3 in Pin Spacing
Rf1-Rf8 Rf15 Rf20 = RES_4P
S0 = SW-SPST: Single-Pole, Single-Throw Switch; Published: 24-Mar-1999; LatestRevisionDate: 17-Jul-2002; LatestRevisionNote: Re-released for DXP Platform.; PackageReference: SPST-2; Publisher: Altium Limited; PackageDescription: Switch; 2 Leads
Signal_Out = HEADER8*3
TXM4 = Header 2X2: Header, 2-Pin, Dual row; LatestRevisionDate: 17-Jul-2002; LatestRevisionNote: Re-released for DXP Platform.; Publisher: Altium Limited
U1 = MP1584: 1.5MHz,5~28V,STEP-DOWN CONVERTER
U2 U2_1 = 78M05
U6 = CH340G: USB2UART
USB_SLAVE USB_SLAVE1 = USB5
X1 = Header_U
Y1 = XTAL: Crystal Oscillator; Published: 8-Jun-2000; LatestRevisionDate: 17-Jul-2002; LatestRevisionNote: Re-released for DXP Platform.; PackageReference: R38; Publisher: Altium Limited; PackageDescription: Crystal, Thru-Hole; 2 Leads; Body 3.1 x 8.2 mm (Dia.xH)